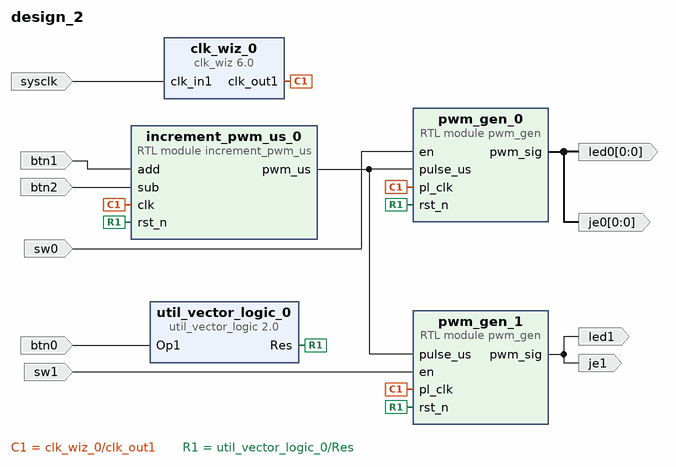
[diagram p0: block diagram of the top level]
# Vivado block design design_2, xc7z020clg400-1, Vivado 2024.2
create_bd_design design_2

create_bd_port -dir I btn0
create_bd_port -dir I btn1
create_bd_port -dir I btn2
create_bd_port -dir O -from 0 -to 0 je0
create_bd_port -dir O -from 0 -to 0 led0
create_bd_port -dir I sw0
create_bd_port -dir I sysclk
create_bd_port -dir I sw1
create_bd_port -dir O je1
create_bd_port -dir O led1

create_bd_cell -type ip -vlnv xilinx.com:ip:clk_wiz:6.0 clk_wiz_0
set_property -dict [list \
  CONFIG.CLKIN1_JITTER_PS 80.0 \
  CONFIG.CLKOUT1_JITTER 124.615 \
  CONFIG.CLKOUT1_PHASE_ERROR 96.948 \
  CONFIG.CLKOUT1_REQUESTED_OUT_FREQ 100.000 \
  CONFIG.CLK_IN1_BOARD_INTERFACE Custom \
  CONFIG.CLK_IN2_BOARD_INTERFACE Custom \
  CONFIG.MMCM_CLKFBOUT_MULT_F 8.000 \
  CONFIG.MMCM_CLKIN1_PERIOD 8.000 \
  CONFIG.MMCM_CLKOUT0_DIVIDE_F 10.000 \
  CONFIG.PRIM_IN_FREQ 125.000 \
  CONFIG.RESET_BOARD_INTERFACE Custom \
  CONFIG.RESET_PORT reset \
  CONFIG.RESET_TYPE ACTIVE_HIGH \
  CONFIG.USE_LOCKED false \
  CONFIG.USE_RESET false \
] [get_bd_cells clk_wiz_0]
create_bd_cell -type module -reference increment_pwm_us increment_pwm_us_0
create_bd_cell -type module -reference pwm_gen pwm_gen_0
set_property -dict {CONFIG.C_CLK_HZ 100000000 CONFIG.C_PULSE_MODE true CONFIG.C_RST_PW_US 1500} [get_bd_cells pwm_gen_0]
create_bd_cell -type ip -vlnv xilinx.com:ip:util_vector_logic:2.0 util_vector_logic_0
set_property -dict {CONFIG.C_OPERATION not CONFIG.C_SIZE 1} [get_bd_cells util_vector_logic_0]
create_bd_cell -type module -reference pwm_gen pwm_gen_1
set_property -dict {CONFIG.C_CLK_HZ 100000000 CONFIG.C_PULSE_MODE false CONFIG.C_RST_PW_US 1500} [get_bd_cells pwm_gen_1]

# ---- connections ----

connect_bd_net -net btn0_1 [get_bd_ports btn0] [get_bd_pins util_vector_logic_0/Op1]
connect_bd_net -net btn1_1 [get_bd_ports btn1] [get_bd_pins increment_pwm_us_0/add]
connect_bd_net -net btn2_1 [get_bd_ports btn2] [get_bd_pins increment_pwm_us_0/sub]
connect_bd_net [get_bd_pins clk_wiz_0/clk_out1] [get_bd_pins pwm_gen_0/pl_clk] [get_bd_pins pwm_gen_1/pl_clk] [get_bd_pins increment_pwm_us_0/clk]
connect_bd_net [get_bd_pins increment_pwm_us_0/pwm_us] [get_bd_pins pwm_gen_0/pulse_us] [get_bd_pins pwm_gen_1/pulse_us]
connect_bd_net [get_bd_pins pwm_gen_1/pwm_sig] [get_bd_ports je1] [get_bd_ports led1]
connect_bd_net -net sw0_1 [get_bd_ports sw0] [get_bd_pins pwm_gen_0/en]
connect_bd_net -net sw1_1 [get_bd_ports sw1] [get_bd_pins pwm_gen_1/en]
connect_bd_net [get_bd_ports sysclk] [get_bd_pins clk_wiz_0/clk_in1]
connect_bd_net [get_bd_pins util_vector_logic_0/Res] \
  [get_bd_pins pwm_gen_0/rst_n] [get_bd_pins pwm_gen_1/rst_n] [get_bd_pins increment_pwm_us_0/rst_n]
connect_bd_net -net util_vector_logic_8_Res [get_bd_pins pwm_gen_0/pwm_sig] [get_bd_ports je0] [get_bd_ports led0]

validate_bd_design
save_bd_design
